# EAGLE schematic PCB 1 (EAGLE 9.0.1)
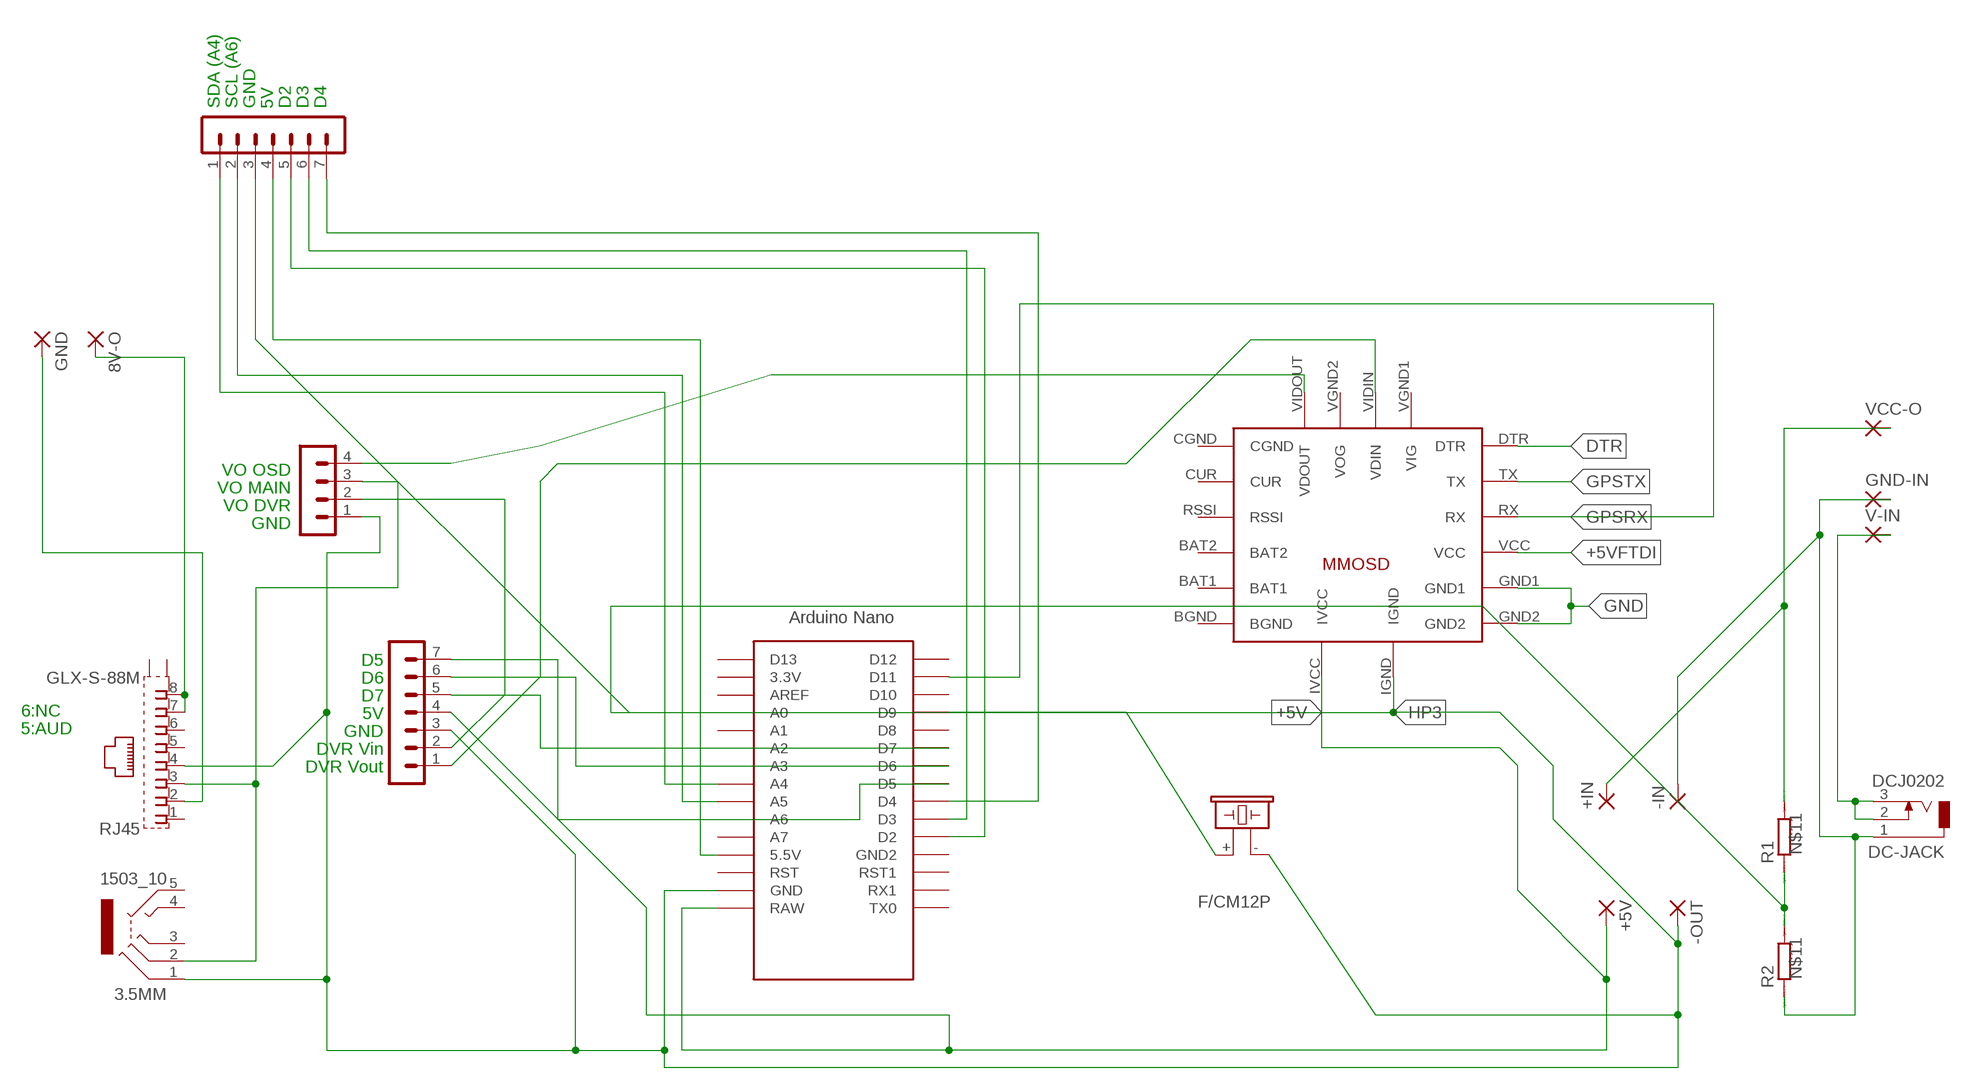
[diagram p0: schematic, sheet 1]

## Parts
3.5MM  1503_10  [1503_10]
8V-O  2,54/1,1  [2,54/1,1]
+5V  SMD2  [SMD1,27-2,54]
+IN  SMD2  [SMD1,27-2,54]
-IN  SMD2  [SMD1,27-2,54]
-OUT  SMD2  [SMD1,27-2,54]
ADRUINO-NANO  NANO  [NANO]
BUZZ  F/CM12P  [F/CM12P]
DC-JACK  DCJ0202  [DCJ0202]
GND  2,54/1,1  [2,54/1,1]
GND-IN  2,54/1,1  [2,54/1,1]
IO1  MA07-1  [MA07-1]
IO2  MA07-1  [MA07-1]
IO3  MA04-1  [MA04-1]
MINIMOSD  MICROMINIMOSDPWR  [MMOSDNVDVID]
R1  R0207/10  [0207/10]
R2  R0207/10  [0207/10]
RJ45  GLX-S-88M  [GLX-S-88M]
V-IN  2,54/1,1  [2,54/1,1]
VCC-O  2,54/1,1  [2,54/1,1]

## Nets
+5V: +5V.1(P) ADRUINO-NANO.RAW IO1.4 MINIMOSD.IVCC
+5VFTDI: MINIMOSD.VCC
DTR: MINIMOSD.DTR
GND: MINIMOSD.GND1 MINIMOSD.GND2
GPSRX: ADRUINO-NANO.D11 MINIMOSD.RX
GPSTX: MINIMOSD.TX
HP1: ADRUINO-NANO.A4 IO2.1
HP2: ADRUINO-NANO.A5 IO2.2
HP3: 3.5MM.1 -OUT.1(P) ADRUINO-NANO.GND BUZZ.- IO1.3 IO2.3 IO3.1 MINIMOSD.IGND RJ45.4
HP5: ADRUINO-NANO.D2 IO2.5
HP6: ADRUINO-NANO.D3 IO2.6
HP7: ADRUINO-NANO.D4 IO2.7
N$2: ADRUINO-NANO.5V(5.5V) IO2.4
N$3: ADRUINO-NANO.A0 R1.1 R2.2
N$4: ADRUINO-NANO.D5 IO1.7
N$5: DC-JACK.2 DC-JACK.3 V-IN.1(P)
N$6: 8V-O.1(P) RJ45.7 RJ45.8
N$7: GND.1(P) RJ45.2
N$8: ADRUINO-NANO.D6 IO1.6
N$9: ADRUINO-NANO.D7 IO1.5
N$10: ADRUINO-NANO.D9 BUZZ.+
N$11: -IN.1(P) DC-JACK.1 GND-IN.1(P) R2.1
N$14: IO1.2 IO3.2
N$15: 3.5MM.2 IO3.3 RJ45.3
N$17: +IN.1(P) R1.2 VCC-O.1(P)
VIDIN: IO1.1 MINIMOSD.VIDIN(VDIN)
VIDOUT: IO3.4 MINIMOSD.VIDOUT(VDOUT)
Unconnected: 3.5MM.3 3.5MM.4 3.5MM.5 ADRUINO-NANO.3.3V ADRUINO-NANO.A1 ADRUINO-NANO.A2 ADRUINO-NANO.A3 ADRUINO-NANO.A6 ADRUINO-NANO.A7 ADRUINO-NANO.AREF ADRUINO-NANO.D8 ADRUINO-NANO.D10 ADRUINO-NANO.D12 ADRUINO-NANO.D13 ADRUINO-NANO.GND1(GND2) ADRUINO-NANO.ICSP1 ADRUINO-NANO.ICSP2 ADRUINO-NANO.ICSP3 ADRUINO-NANO.ICSP4 ADRUINO-NANO.ICSP5 ADRUINO-NANO.ICSP6 ADRUINO-NANO.RST ADRUINO-NANO.RST1 ADRUINO-NANO.RX1 ADRUINO-NANO.TX0 MINIMOSD.CUR MINIMOSD.RSSI MINIMOSD.VGND1(VIG) MINIMOSD.VGND2(VOG) RJ45.1 RJ45.5 RJ45.6 RJ45.S1 RJ45.S2

## Notes on the sheet
- SDA (A4) | SCL (A6) | GND | 5V | D2 | D3 | D4
- VO OSD
- VO MAIN
- VO DVR
- GND
- D5
- D6
- D7
- 5V
- GND
- 6:NC
- DVR Vin
- 5:AUD
- DVR Vout

## Power pins joined to a net without a drawn wire
BAT1: MINIMOSD.BAT1
BAT2: MINIMOSD.BAT2
BGND: MINIMOSD.BGND
CGND: MINIMOSD.CGND

## Library data of the parts
3.5MM = con-lumberg:1503_10: Jack connectors according to JISC 6560, 3.5 mm Klinkeneinbaukupplung, 3,5 mm, 4-polig/stereo, abgewinkelte Ausführung Source: http://www.lumberg.de/Produkte/PDFs/1503_10.pdf; OC_FARNELL: 1308868; OC_NEWARK: unknown
8V-O GND GND-IN V-IN VCC-O = wirepad:2,54/1,1: THROUGH-HOLE PAD
+5V +IN -IN -OUT = wirepad:SMD2: SMD PAD
ADRUINO-NANO = Arduino-clone:NANO: Arduino Nano
BUZZ = buzzer:F/CM12P: BUZZER Source: Buerklin; OC_FARNELL: unknown; OC_NEWARK: unknown; SPICEPREFIX: X
DC-JACK = con-jack:DCJ0202: DC POWER JACK Source: DCJ0202.pdf; OC_FARNELL: unknown; OC_NEWARK: unknown
IO1 IO2 = con-lstb:MA07-1: PIN HEADER; OC_FARNELL: unknown; OC_NEWARK: unknown
IO3 = con-lstb:MA04-1: PIN HEADER; OC_FARNELL: unknown; OC_NEWARK: unknown
MINIMOSD = FPVTools:MICROMINIMOSDPWR
R1 R2 = eagle-ltspice:R: RESISTOR, European symbol; SPICEMODEL: NONE; SPICEPREFIX: R
RJ45 = con-kycon:GLX-S-88M: Mod. Jack, Right Angle, 8 posiotion, 8 contatcs RJ45 Source: GLX-S-88M.pdf; OC_FARNELL: unknown; OC_NEWARK: unknown

## Net classes
0 default: width 0.762 mm, drill 0.508 mm, clearance 0.508 mm
1 test: width 0.1 mm, drill 0.508 mm, clearance 0.508 mm